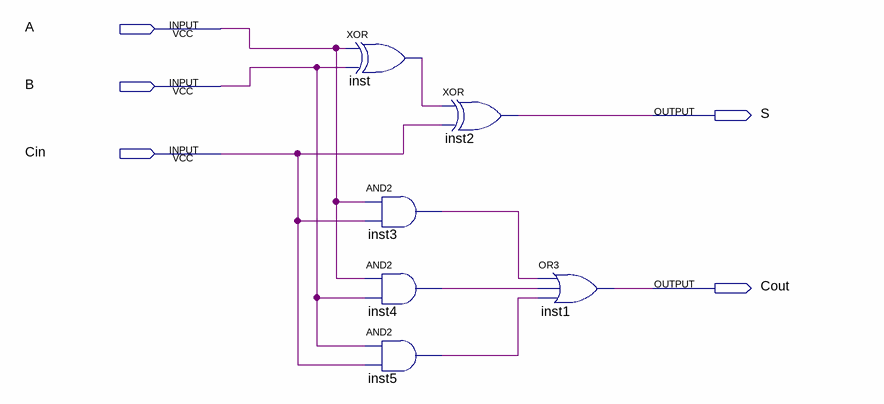
[diagram p0: schematic sheet]
// Quartus schematic somador.bdf as structural Verilog: 6 symbols, 5 pins
module somador (
  input  A,
  input  B,
  input  Cin,
  output S,
  output Cout
);

  wire inst3_out, inst4_out, inst5_out, inst_out;

  xor inst (inst_out, A, B);
  and inst3 (inst3_out, A, Cin);
  and inst4 (inst4_out, A, B);
  and inst5 (inst5_out, B, Cin);
  xor inst2 (S, inst_out, Cin);
  or inst1 (Cout, inst3_out, inst4_out, inst5_out);
endmodule
